# Altium project BatteryCharger.PrjPcb
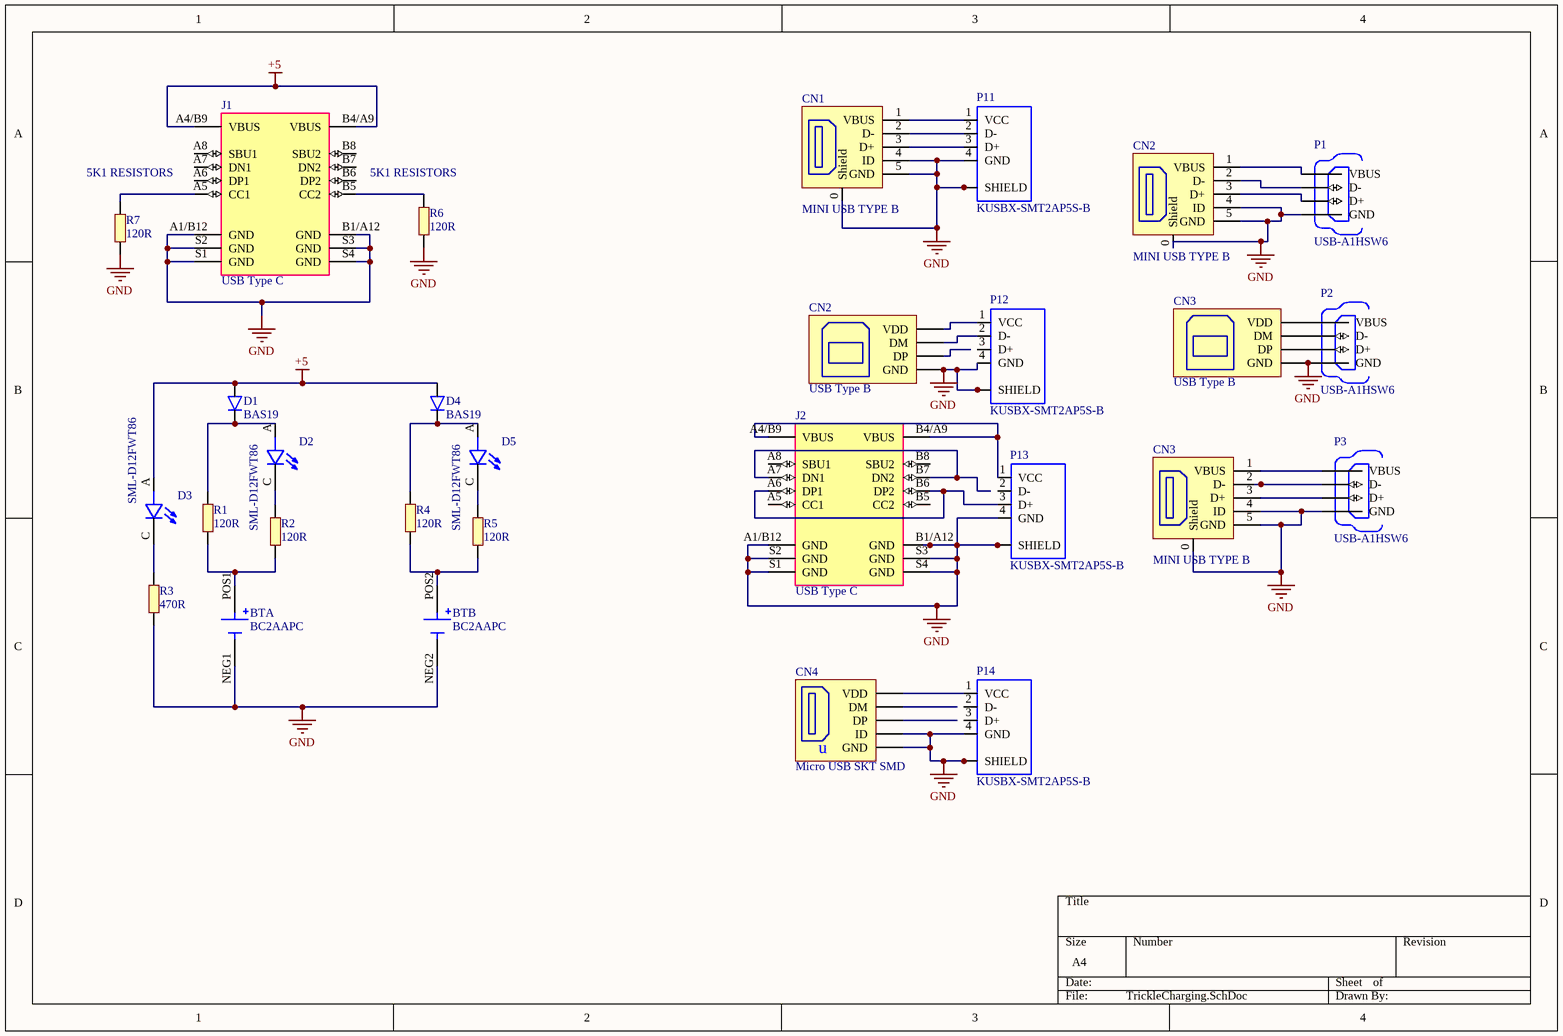
[diagram p0: TrickleCharging.SchDoc]
1 sheet, 28 parts. Net scope: global (net labels, ports and power ports of the same name join across sheets).

## Sheet TrickleCharging.SchDoc
size A4

### Parts
(Parts that share a designator on the sheet are numbered #1, #2 ... from top to bottom, then left to right.)
BT  BC2AAPC  [BAT_BC2AAPC - dompact]  (parts A,B of 2)
CN1  MINI USB TYPE B  [MINI USB-B]
CN2#1  MINI USB TYPE B  [MINI USB-B]
CN2#2  USB Type B  [USB-B-S-RA]
CN3#1  USB Type B  [USB-B-S-RA]
CN3#2  MINI USB TYPE B  [MINI USB-B]
CN4  Micro USB SKT SMD  [10103594-0001LF]
D1  BAS19  [SOT-23]
D2  SML-D12FWT86  [LED_SML-D12FWT86]
D3  SML-D12FWT86  [LED_SML-D12FWT86]
D4  BAS19  [SOT-23]
D5  SML-D12FWT86  [LED_SML-D12FWT86]
J1  USB Type C  [GCT_USB4110-GF-A_REVB]
J2  USB Type C  [GCT_USB4110-GF-A_REVB]
P1  USB-A1HSW6  [OST_USB-A1HSW6]
P2  USB-A1HSW6  [OST_USB-A1HSW6]
P3  USB-A1HSW6  [OST_USB-A1HSW6]
P11  KUSBX-SMT2AP5S-B  [KYCON_KUSBX-SMT2AP5S-B]
P12  KUSBX-SMT2AP5S-B  [KYCON_KUSBX-SMT2AP5S-B]
P13  KUSBX-SMT2AP5S-B  [KYCON_KUSBX-SMT2AP5S-B]
P14  KUSBX-SMT2AP5S-B  [KYCON_KUSBX-SMT2AP5S-B]
R1  120R  [RES 0603 120R]
R2  120R  [RES 0603 120R]
R3  470R  [RES 0603 470R]
R4  120R  [RES 0603 120R]
R5  120R  [RES 0603 120R]
R6  120R  [RES 0603 120R]
R7  120R  [RES 0603 120R]

### Nets
+5: D1.1(A) D3.A D4.1(A) J1.A4/B9(VBUS) J1.B4/A9(VBUS)
GND: BT.NEG1 BT.NEG2 CN1.0(Shield) CN1.4(ID) CN1.5(GND) CN2#1.0(Shield) CN2#1.4(ID) CN2#1.5(GND) CN2#2.4(GND) CN3#1.4(GND) CN3#2.0(Shield) CN3#2.4(ID) CN3#2.5(GND) CN4.4(ID) CN4.5(GND) J1.A1/B12(GND) J1.B1/A12(GND) J1.S1(GND) J1.S2(GND) J1.S3(GND) J1.S4(GND) J2.A1/B12(GND) J2.B1/A12(GND) J2.S1(GND) J2.S2(GND) J2.S3(GND) J2.S4(GND) P1.4(GND) P2.4(GND) P3.4(GND) P11.4(GND) P11.P1(SHIELD) P11.P2(SHIELD) P12.4(GND) P12.P1(SHIELD) P12.P2(SHIELD) P13.4(GND) P13.P1(SHIELD) P13.P2(SHIELD) P14.4(GND) P14.P1(SHIELD) P14.P2(SHIELD) R3.1 R6.1 R7.1
NetBT_POS1: BT.POS1 R1.1 R2.1
NetBT_POS2: BT.POS2 R4.1 R5.1
NetCN1_1: CN1.1(VBUS) P11.1(VCC)
NetCN1_2: CN1.2(D-) P11.2(D-)
NetCN1_3: CN1.3(D+) P11.3(D+)
NetCN2#1_1: CN2#1.1(VBUS) P1.1(VBUS)
NetCN2#1_2: CN2#1.2(D-) P1.2(D-)
NetCN2#1_3: CN2#1.3(D+) P1.3(D+)
NetCN2#2_1: CN2#2.1(VDD) P12.1(VCC)
NetCN2#2_2: CN2#2.2(DM) P12.2(D-)
NetCN3#1_1: CN3#1.1(VDD) P2.1(VBUS)
NetCN3#1_2: CN3#1.2(DM) P2.2(D-)
NetCN3#1_3: CN3#1.3(DP) P2.3(D+)
NetCN3#2_1: CN3#2.1(VBUS) P3.1(VBUS)
NetCN3#2_2: CN3#2.2(D-) P3.2(D-)
NetCN3#2_3: CN3#2.3(D+) P3.3(D+)
NetCN4_1: CN4.1(VDD) P14.1(VCC)
NetD1_3: D1.3(K) D2.A R1.2
NetD2_C: D2.C R2.2
NetD3_C: D3.C R3.2
NetD4_3: D4.3(K) D5.A R4.2
NetD5_C: D5.C R5.2
NetJ1_A5: J1.A5(CC1) R7.2
NetJ1_B5: J1.B5(CC2) R6.2
NetJ2_A4/B9: J2.A4/B9(VBUS) J2.B4/A9(VBUS) P13.1(VCC)
NetJ2_A6: J2.A6(DP1) J2.B6(DP2) P13.3(D+)
NetJ2_A7: J2.A7(DN1) J2.B7(DN2)

Not connected (* = marked no-connect by the designer): CN2#2 3(DP); CN4 2(DM) 3(DP); J1 A6(DP1) A7(DN1) A8(SBU1) B6(DP2) B7(DN2) B8(SBU2); J2 A5(CC1) A8(SBU1) B5(CC2) B8(SBU2); P12 3(D+); P13 2(D-); P14 2(D-) 3(D+)

### Notes on the sheet
- (near R7) 5K1 RESISTORS
- 5K1 RESISTORS
- (in symbol Micro USB SKT SMD) u

### Library data of the parts
BT = BC2AAPC: BATTERY HOLDER AA 2 CELL PC PIN; MF: MPD; Value: *; SnapEDA_Link: https://www.snapeda.com/parts/BC2AAPC/MPD/view-part/4389051/?ref=snap; Price: None; Availability: Unavailable; Package: None; MP: BC2AAPC
CN1 CN2#1 CN3#2 = MINI USB TYPE B: USB Mini B Socket; UA P/N: 9786465; Value: MINI USB TYPE B; Type: MOLEX 548190519; LatestRevisionDate: 12/03/20
CN2#2 CN3#1 = USB Type B: Standard USB Type B Socket; UA P/N: 211-2373; Value: USB Type B; Type: USB-B-S-RA; LatestRevisionDate: 12/03/20
CN4 = Micro USB SKT SMD: USB MicroB Socket; UA P/N: 229-3752; Value: Micro USB SKT SMD; Type: Micro USB SKT SMD; LatestRevisionDate: 12/03/20
D1 D4 = BAS19: Diode Standard 250V 200mA Surface Mount SOT-23-3 _TO-236_; MF: onsemi; MP: BAS19LT1G; Value: BAS19; SnapEDA_Link: https://www.snapeda.com/parts/BAS21/ON%20Semiconductor/view-part/2747894/?ref=snap; Price: US$0.0277; Availability: Unavailable; Package: SOT-23-3 Rectron; LCSC: C232582
D2 D3 D5 = SML-D12FWT86: Green 565nm LED Indication - Discrete 2.2V 0603 (1608 Metric); MF: Rohm; Check_prices: https://www.snapeda.com/parts/SML-D12FWT86/Rohm/view-part/2753923/?ref=eda; Package: 0603 Rohm; Price: None; Value: GREEN; MP: SML-D12FWT86; SnapEDA_Link: https://www.snapeda.com/parts/SML-D12FWT86/Rohm/view-part/2753923/?ref=snap; Availability: Good; Purchase-URL: https://pricing.snapeda.com/search/part/SML-D12FWT86/?ref=eda
J1 J2 = USB4110-GF-A_REVB: USB-C (USB TYPE-C) USB 2.0 Type C. Receptacle Connector 24 (16+8 Dummy) Position Surface Mount, Right Angle; Through Hole; MF: GCT; Value: USB Type C; Price: None; Package: None; SnapEDA_Link: https://www.snapeda.com/parts/USB4110-GF-A/Global%20Connector%20Technology/view-part/4001167/?ref=snap; Availability: Warning; MP: USB4110-GF-A; Purchase-URL: https://pricing.snapeda.com/search/part/USB4110-GF-A/?ref=eda; Check_prices: https://www.snapeda.com/parts/USB4110-GF-A/Global%20Connector%20Technology/view-part/4001167/?ref=eda; Mouser: 640-USB4110-GF-A; LSCS: *
P1-P3 = USB-A1HSW6: USB - A Receptacle Connector 4 Position Through Hole, Right Angle; Price: None; Package: None; Availability: Unavailable; MP: USB-A1HSW6; Value: *
P11-P14 = KUSBX-SMT2AP5S-B: USB-A _USB TYPE-A_ Plug Connector 4 Position Surface Mount, Right Angle; Through Hole; MF: Kycon; SnapEDA_Link: https://www.snapeda.com/parts/KUSBX-SMT2AP5S-B/Kycon/view-part/285961/?ref=snap; Availability: Unavailable; Package: None; Price: None; MP: KUSBX-SMT2AP5S-B; Value: *
R1 R2 R4-R7 = RES0603_120R: 1/10W ±1% 120Ω ±100ppm/℃ 0603; Value: 120R; Footprint: 0603; Type: THICK FILM; Price: US$0.0018
R3 = RES0603_470R: 1/10W ±1% 470Ω ±100ppm/℃ 0603; Value: 470R; Footprint: 0603; Type: THICK FILM; Price: US$0.0018